# Altium schematic sheet 05_Button.SchDoc
size A4
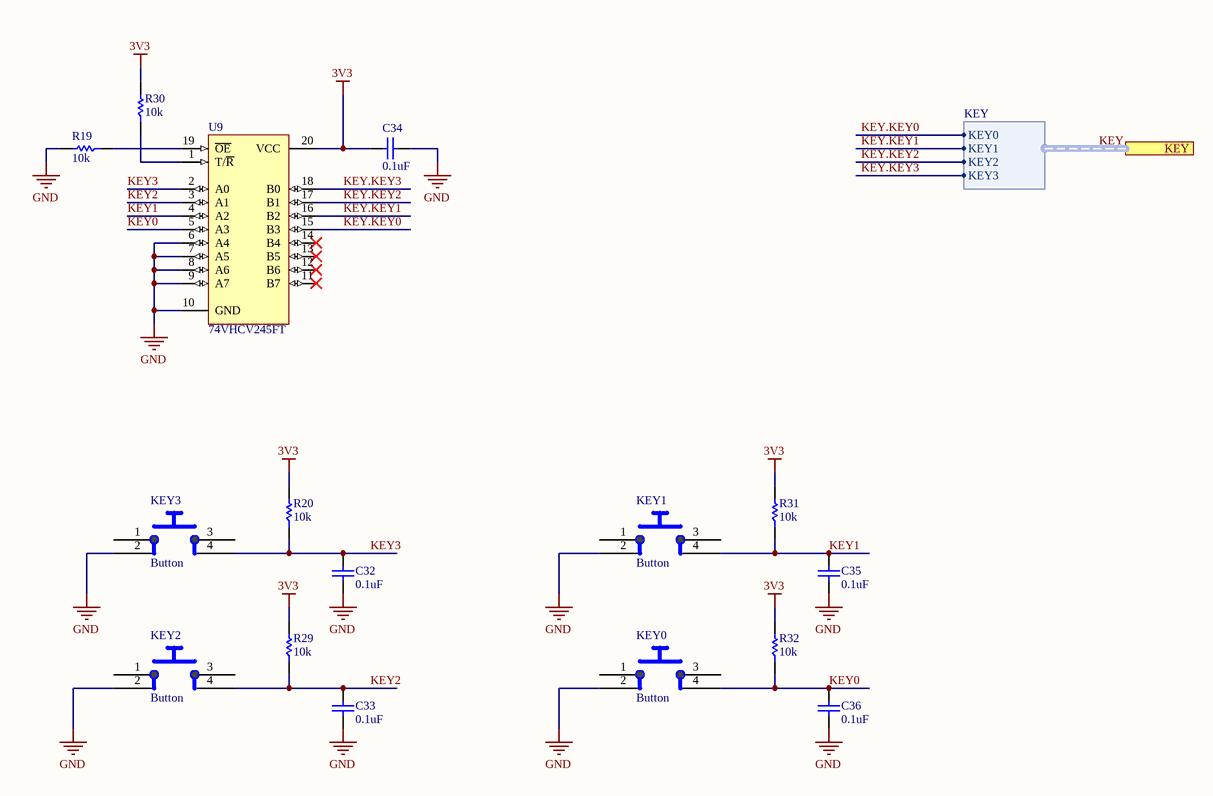
[diagram p0: 05_Button.SchDoc]

## Parts
C32  0.1uF  [CAP0603R]
C33  0.1uF  [CAP0603R]
C34  0.1uF  [CAP0603R]
C35  0.1uF  [CAP0603R]
C36  0.1uF  [CAP0603R]
KEY0  Button  [But_PTS645SMT]
KEY1  Button  [But_PTS645SMT]
KEY2  Button  [But_PTS645SMT]
KEY3  Button  [But_PTS645SMT]
R19  10k  [RES0603R]
R20  10k  [RES0603R]
R29  10k  [RES0603R]
R30  10k  [RES0603R]
R31  10k  [RES0603R]
R32  10k  [RES0603R]
U9  74VHCV245FT  [TSSOP20B]

## Ports
KEY (harness KEY)

## Harnesses
KEY: KEY0, KEY1, KEY2, KEY3

## Nets
3V3: C34.1 R20.2 R29.2 R30.2 R31.2 R32.2 U9.20(VCC)
GND: C32.1 C33.1 C34.2 C35.1 C36.1 KEY0.2 KEY1.2 KEY2.2 KEY3.2 R19.2 U9.6(A4) U9.7(A5) U9.8(A6) U9.9(A7) U9.10(GND)
KEY0: C36.2 KEY0.4 R32.1 U9.5(A3)
KEY1: C35.2 KEY1.4 R31.1 U9.4(A2)
KEY2: C33.2 KEY2.4 R29.1 U9.3(A1)
KEY3: C32.2 KEY3.4 R20.1 U9.2(A0)
KEY.KEY0: U9.15(B3) ; port KEY.KEY0
KEY.KEY1: U9.16(B2) ; port KEY.KEY1
KEY.KEY2: U9.17(B1) ; port KEY.KEY2
KEY.KEY3: U9.18(B0) ; port KEY.KEY3
NetR19_1: R19.1 U9.19(~{OE})
NetR30_1: R30.1 U9.1(T/~{R})

Not connected (* = marked no-connect by the designer): KEY0 1(29) 3(29); KEY1 1(29) 3(29); KEY2 1(29) 3(29); KEY3 1(29) 3(29); U9 11(B7)* 12(B6)* 13(B5)* 14(B4)*

## Buses and harness runs
harness KEY = port KEY

## Library data of the parts
C32-C36 = C: Capacitor; Class I: Passive; Load: YES; Revision: July-2002: Re-released for DXP Platform.; Supplier 1: Digi-Key; Supplier Part Number 1: 311-3560-1-ND; Value: 0.1uF; Mount: SMD
KEY0-KEY3 = BUT: Switching: off-mom; Load: YES; Supplier 1: Digi-Key; Supplier Part Number 1: CKN9112CT-ND; Mount: SMD
R19 R20 R29-R32 = R: Resistor; Load: YES; Mount: SMD; Supplier 1: Digi-Key; Supplier Part Number 1: 311-10.0KHRCT-ND; Value: 10k
U9 = 74VHCV245FT: Octal Schmitt Bus Transceiver with 3-State Outputs; 01 Created By: Rodrigo Maureira @ 2018-04-05; Load: YES; ComponentLink1Description: Manufacturer Link; ComponentLink1URL: http://www.ti.com/; ComponentLink2Description: Datasheet; ComponentLink2URL: http://www-s.ti.com/sc/ds/sn54ahc245.pdf; 02 Reviewed By: *; Supplier 1: Digi-Key; Supplier Part Number 1: 74VHCV245FTCT-ND; Mount: SMD